# Altium project FLS ADC_A Aug_14_2012.PrjPcb
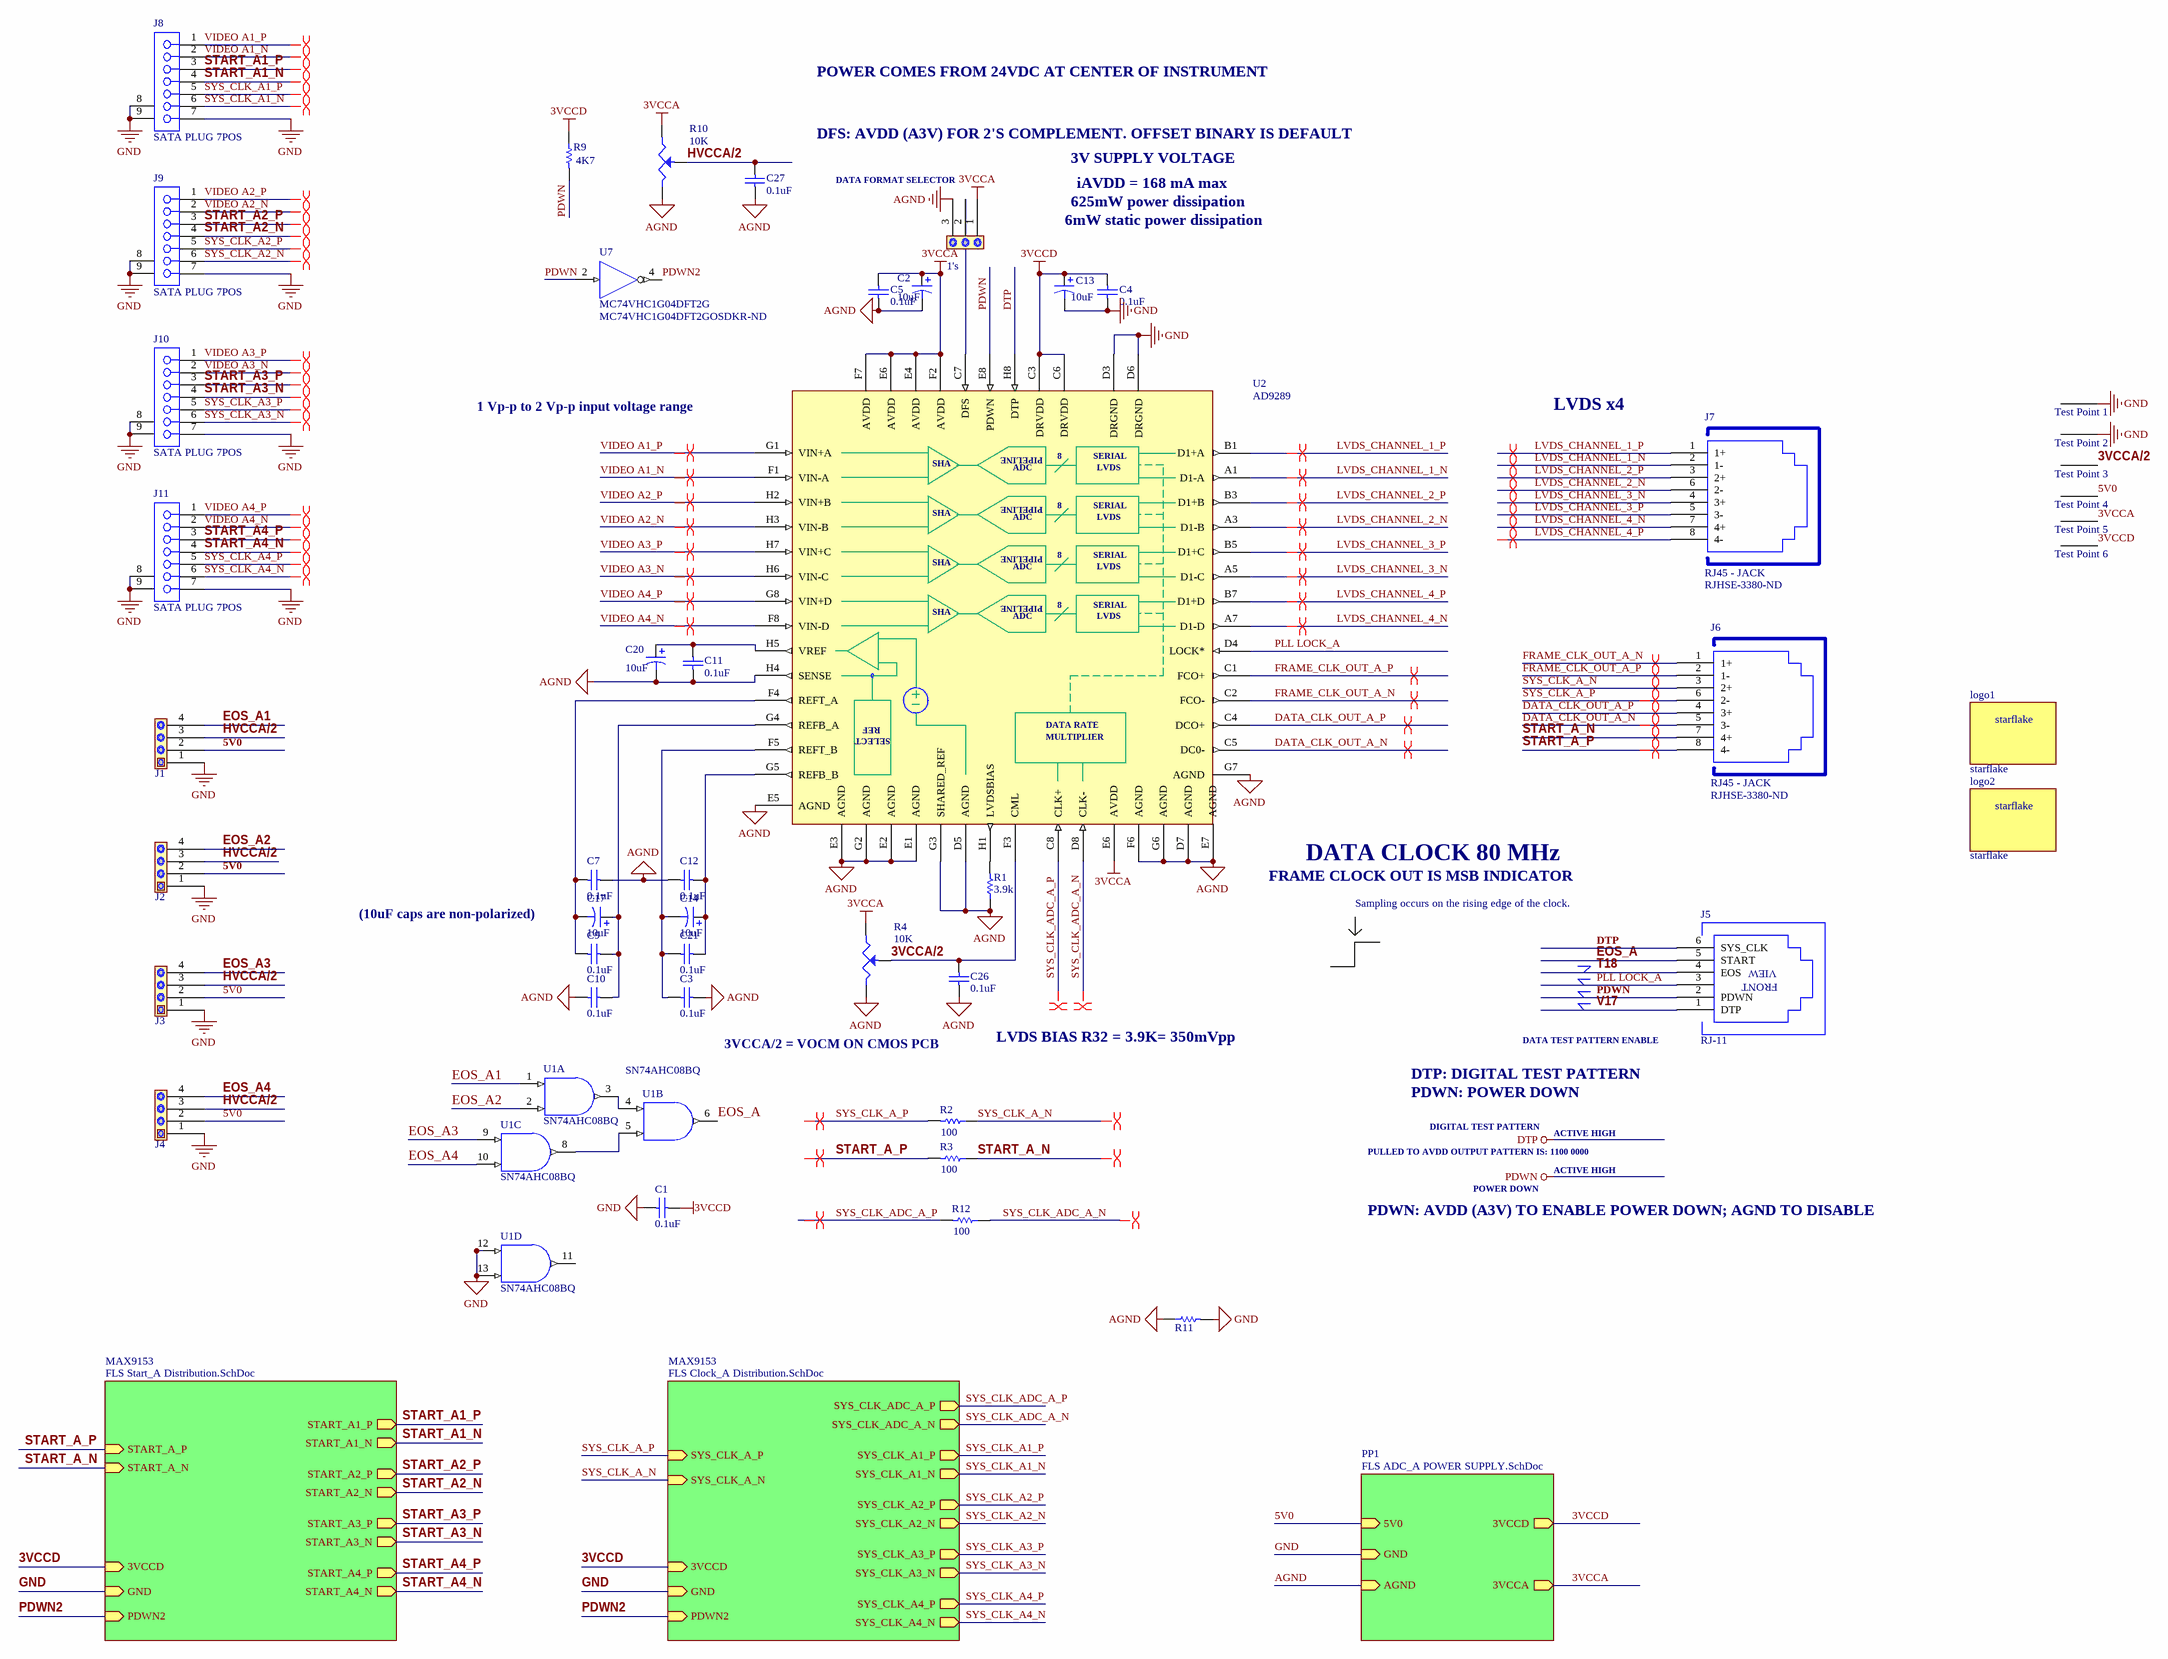
[diagram p0: FLS ADC_ A.SchDoc]
4 sheets, 63 parts. Net scope: hierarchical (ports join the sheet entries above them; power ports are global).
Board file: FLS ADC_A.PcbDoc
Sheets:
  FLS ADC_ A.SchDoc
    PP1 = FLS ADC_A POWER SUPPLY.SchDoc
    MAX9153 = FLS Clock_A Distribution.SchDoc
    MAX9153 = FLS Start_A Distribution.SchDoc

## Sheet FLS ADC_ A.SchDoc
size 558 x 401 mm; Organization: Carnegie Institution of Washington; SheetNumber: 1; SheetTotal: 0; CompanyName: Carnegie Observatories; DrawnBy: alanb; Engineer: Alan Bagish; PageSetup: Record=PageOptions|CenterHorizontal=True|CenterVertical=True|PrintScale=0.47|XCorrection=1.00|YCorrection=1.00|PrintKind=0|BorderSize=5000000|LeftOffset=0|BottomOffset=0|Orientation=2|PaperLength=1000|PaperWidth=1000|Scale=100|PaperSource=259|PrintQuality=600|MediaType=1|DitherType=10|PaperKind=Letter (8.5 x 11")|PrintScaleMode=1; DocumentName: FLS FRONT END

### Parts
1's  SW-SPDT  [SIP3]  (value not drawn)
C1  0.1uF  [0805 slim]
C2  10uF  [1206]
C3  0.1uF  [0805 slim]
C4  0.1uF  [0805 slim]
C5  0.1uF  [0805 slim]
C7  0.1uF  [0805 slim]
C9  0.1uF  [0805 slim]
C10  0.1uF  [0805 slim]
C11  0.1uF  [0805 slim]
C12  0.1uF  [0805 slim]
C13  10uF  [1206]
C14  10uF  [1206]
C17  10uF  [1206]
C20  10uF  [1206]
C21  0.1uF  [0805 slim]
C26  0.1uF  [0805 slim]
C27  0.1uF  [0805 slim]
J1  CON4  [SIP4]  (value not drawn)
J2  CON4  [SIP4]  (value not drawn)
J3  CON4  [SIP4]  (value not drawn)
J4  CON4  [SIP4]  (value not drawn)
J5  RJ-11  [RJ11 - Vertical]
J6  RJ45 - JACK  Supplier Part Number 1: RJHSE-3380-ND  [RJ45 Vertical Single]
J7  RJ45 - JACK  Supplier Part Number 1: RJHSE-3380-ND  [RJ45 Vertical Single]
J8  SATA PLUG 7POS  [Molex 471554001]
J9  SATA PLUG 7POS  [Molex 471554001]
J10  SATA PLUG 7POS  [Molex 471554001]
J11  SATA PLUG 7POS  [Molex 471554001]
logo1  starflake  [STARFLAKE]
logo2  starflake  [STARFLAKE]
R1  value 3.9k  [J1-0603]  (hidden comment: 100)
R2  100  [J1-0603]
R3  100  [J1-0603]
R4  10K  [V1240W]
R9  4K7  [1206]
R10  10K  [V1240W]
R11  Jumper 0805(2012)  [RESC0805(2012)_N]  (value not drawn)
R12  100  [J1-0603]
Test_Point_1  TP-107  [TP-107]  (value not drawn)
Test_Point_2  TP-107  [TP-107]  (value not drawn)
Test_Point_3  TP-107  [TP-107]  (value not drawn)
Test_Point_4  TP-107  [TP-107]  (value not drawn)
Test_Point_5  TP-107  [TP-107]  (value not drawn)
Test_Point_6  TP-107  [TP-107]  (value not drawn)
U1  SN74AHC08BQ  [DGV014]  (parts A,B,C,D of 4)
U2  AD9289  [BGA80P8X8-64B]
U7  MC74VHC1G04DFT2G  Supplier Part Number 1: MC74VHC1G04DFT2GOSDKR-ND  [419A-01_N]

### Sub-sheets
MAX9153 = FLS Clock_A Distribution.SchDoc: GND (in), 3VCCD (in), SYS_CLK_A1_P (out), SYS_CLK_A1_N (out), SYS_CLK_A2_P (out), SYS_CLK_A2_N (out), SYS_CLK_A3_P (out), SYS_CLK_A3_N (out), SYS_CLK_A4_P (out), SYS_CLK_A4_N (out), SYS_CLK_ADC_A_P (out), SYS_CLK_ADC_A_N (out), PDWN2 (in), SYS_CLK_A_P (in), SYS_CLK_A_N (in)
MAX9153 = FLS Start_A Distribution.SchDoc: GND (in), 3VCCD (in), START_A2_P (out), START_A2_N (out), START_A3_P (out), START_A3_N (out), START_A4_P (out), START_A4_N (out), START_A1_P (out), START_A1_N (out), PDWN2 (in), START_A_P (in), START_A_N (in)
PP1 = FLS ADC_A POWER SUPPLY.SchDoc: 5V0 (in), GND (in), 3VCCD (out), 3VCCA (out), AGND (in)

### Nets
3VCCA: 1's.1 C2.1 C5.1 R4.CCW R10.CCW Test_Point_5.1 U2.E4(AVDD) U2.E6(AVDD) U2.F2(AVDD) U2.F7(AVDD) ; sheet PP1/3VCCA
3VCCD: C1.2 C4.1 C13.1 R9.1 Test_Point_6.1 U1.14(VCC) U2.C3(DRVDD) U2.C6(DRVDD) U7.5(VDD) ; sheet PP1/3VCCD, sheet MAX9153/3VCCD, sheet MAX9153/3VCCD
AGND: 1's.3 C2.2 C3.2 C5.2 C7.2 C10.1 C11.2 C12.1 C20.2 C26.1 C27.1 R1.1 R4.CW R10.CW R11.1 U2.D5(AGND) U2.D7(AGND) U2.E1(AGND) U2.E2(AGND) U2.E3(AGND) U2.E5(AGND) U2.E7(AGND) U2.F6(AGND) U2.G2(AGND) U2.G3(SHARED_REF) U2.G6(AGND) U2.G7(AGND) U2.H4(SENSE) ; sheet PP1/AGND
DTP: J5.6(SYS_CLK) U2.H8(DTP)
GND: C1.1 C4.2 C13.2 J1.1 J2.1 J3.1 J4.1 J6.MH3 J6.MH4 J7.MH3 J7.MH4 J8.7 J8.8(MH1) J8.9(MH2) J9.7 J9.8(MH1) J9.9(MH2) J10.7 J10.8(MH1) J10.9(MH2) J11.7 J11.8(MH1) J11.9(MH2) R11.2 Test_Point_1.1 Test_Point_2.1 U1.7(GND) U1.12(A) U1.13(B) U2.D3(DRGND) U2.D6(DRGND) U7.3(GND) ; sheet PP1/GND, sheet MAX9153/GND, sheet MAX9153/GND
PDWN: J5.2(PDWN) R9.2 U2.E8(PDWN) U7.2(IN)
3VCCA/2: C26.2 R4.W Test_Point_3.1 U2.F3(CML)
5V0: J1.2 J2.2 J3.2 J4.2 Test_Point_4.1 ; sheet PP1/5V0
DATA_CLK_OUT_A_N: J6.5(3-) U2.C5(DC0-)
DATA_CLK_OUT_A_P: J6.4(3+) U2.C4(DCO+)
EOS_A: J5.5(START) U1.6(Y)
EOS_A1: J1.4 U1.1(A)
EOS_A2: J2.4 U1.2(B)
EOS_A3: J3.4 U1.9(A)
EOS_A4: J4.4 U1.10(B)
FRAME_CLK_OUT_A_N: J6.1(1+) U2.C2(FCO-)
FRAME_CLK_OUT_A_P: J6.2(1-) U2.C1(FCO+)
HVCCA/2: C27.2 J1.3 J2.3 J3.3 J4.3 R10.W
LVDS_CHANNEL_1_N: J7.2(1-) U2.A1(D1-A)
LVDS_CHANNEL_1_P: J7.1(1+) U2.B1(D1+A)
LVDS_CHANNEL_2_N: J7.6(2-) U2.A3(D1-B)
LVDS_CHANNEL_2_P: J7.3(2+) U2.B3(D1+B)
LVDS_CHANNEL_3_N: J7.4(3+) U2.A5(D1-C)
LVDS_CHANNEL_3_P: J7.5(3-) U2.B5(D1+C)
LVDS_CHANNEL_4_N: J7.7(4+) U2.A7(D1-D)
LVDS_CHANNEL_4_P: J7.8(4-) U2.B7(D1+D)
PDWN2: U7.4(~{OUT}) ; sheet MAX9153/PDWN2, sheet MAX9153/PDWN2
PLL LOCK_A: J5.3 U2.D4(LOCK*)
START_A1_N: J8.4 ; sheet MAX9153/START_A1_N
START_A1_P: J8.3 ; sheet MAX9153/START_A1_P
START_A2_N: J9.4 ; sheet MAX9153/START_A2_N
START_A2_P: J9.3 ; sheet MAX9153/START_A2_P
START_A3_N: J10.4 ; sheet MAX9153/START_A3_N
START_A3_P: J10.3 ; sheet MAX9153/START_A3_P
START_A4_N: J11.4 ; sheet MAX9153/START_A4_N
START_A4_P: J11.3 ; sheet MAX9153/START_A4_P
START_A_N: J6.7(4+) R3.1 ; sheet MAX9153/START_A_N
START_A_P: J6.8(4-) R3.2 ; sheet MAX9153/START_A_P
SYS_CLK_A1_N: J8.6 ; sheet MAX9153/SYS_CLK_A1_N
SYS_CLK_A1_P: J8.5 ; sheet MAX9153/SYS_CLK_A1_P
SYS_CLK_A2_N: J9.6 ; sheet MAX9153/SYS_CLK_A2_N
SYS_CLK_A2_P: J9.5 ; sheet MAX9153/SYS_CLK_A2_P
SYS_CLK_A3_N: J10.6 ; sheet MAX9153/SYS_CLK_A3_N
SYS_CLK_A3_P: J10.5 ; sheet MAX9153/SYS_CLK_A3_P
SYS_CLK_A4_N: J11.6 ; sheet MAX9153/SYS_CLK_A4_N
SYS_CLK_A4_P: J11.5 ; sheet MAX9153/SYS_CLK_A4_P
SYS_CLK_A_N: J6.3(2+) R2.1 ; sheet MAX9153/SYS_CLK_A_N
SYS_CLK_A_P: J6.6(2-) R2.2 ; sheet MAX9153/SYS_CLK_A_P
SYS_CLK_ADC_A_N: R12.1 U2.D8(CLK-) ; sheet MAX9153/SYS_CLK_ADC_A_N
SYS_CLK_ADC_A_P: R12.2 U2.C8(CLK+) ; sheet MAX9153/SYS_CLK_ADC_A_P
T18: J5.4(EOS)
V17: J5.1(DTP)
VIDEO A1_N: J8.2 U2.F1(VIN-A)
VIDEO A1_P: J8.1 U2.G1(VIN+A)
VIDEO A2_N: J9.2 U2.H3(VIN-B)
VIDEO A2_P: J9.1 U2.H2(VIN+B)
VIDEO A3_N: J10.2 U2.H6(VIN-C)
VIDEO A3_P: J10.1 U2.H7(VIN+C)
VIDEO A4_N: J11.2 U2.F8(VIN-D)
VIDEO A4_P: J11.1 U2.G8(VIN+D)
Net1's_2: 1's.2 U2.C7(DFS)
NetC3_1: C3.1 C14.2 C21.1 U2.F5(REFT_B)
NetC7_1: C7.1 C9.1 C17.2 U2.F4(REFT_A)
NetC9_2: C9.2 C10.2 C17.1 U2.G4(REFB_A)
NetC11_1: C11.1 C20.1 U2.H5(VREF)
NetC12_2: C12.2 C14.1 C21.2 U2.G5(REFB_B)
NetR1_2: R1.2 U2.H1(LVDSBIAS)
NetU1_3: U1.3(Y) U1.4(A)
NetU1_5: U1.5(B) U1.8(Y)

Not connected (* = marked no-connect by the designer): J6 MH1 MH2; J7 MH1 MH2; U1 11(Y)

### Layout directives
differential pair: DATA_CLK_OUT_A_N, DATA_CLK_OUT_A_P, FRAME_CLK_OUT_A_N, FRAME_CLK_OUT_A_P, LVDS_CHANNEL_1_N, LVDS_CHANNEL_1_P, LVDS_CHANNEL_2_N, LVDS_CHANNEL_2_P, LVDS_CHANNEL_3_N, LVDS_CHANNEL_3_P, LVDS_CHANNEL_4_N, LVDS_CHANNEL_4_P, START_A1_N, START_A1_P, START_A2_N, START_A2_P, START_A3_N, START_A3_P, START_A4_N, START_A4_P, START_A_N, START_A_P, SYS_CLK_A1_N, SYS_CLK_A1_P, SYS_CLK_A2_N, SYS_CLK_A2_P, SYS_CLK_A3_N, SYS_CLK_A3_P, SYS_CLK_A4_N, SYS_CLK_A4_P, SYS_CLK_A_N, SYS_CLK_A_P, SYS_CLK_ADC_A_N, SYS_CLK_ADC_A_P, VIDEO A1_N, VIDEO A1_P, VIDEO A2_N, VIDEO A2_P, VIDEO A3_N, VIDEO A3_P, VIDEO A4_N, VIDEO A4_P

### Notes on the sheet
- POWER COMES FROM 24VDC AT CENTER OF INSTRUMENT
- DFS: AVDD (A3V) FOR 2'S COMPLEMENT. OFFSET BINARY IS DEFAULT
- DATA FORMAT SELECTOR
- 3V SUPPLY VOLTAGE
- iAVDD = 168 mA max
- 6mW static power dissipation
- 625mW power dissipation
- 1 Vp-p to 2 Vp-p input voltage range
- LVDS x4
- FRAME CLOCK OUT IS MSB INDICATOR
- DATA CLOCK 80 MHz
- (10uF caps are non-polarized)
- Sampling occurs on the rising edge of the clock.
- 3VCCA/2 = VOCM ON CMOS PCB
- LVDS BIAS R32 = 3.9K= 350mVpp
- DATA TEST PATTERN ENABLE
- DTP: DIGITAL TEST PATTERN
- PDWN: POWER DOWN
- DIGITAL TEST PATTERN
- ACTIVE HIGH
- PULLED TO AVDD OUTPUT PATTERN IS: 1100 0000
- POWER DOWN
- PDWN: AVDD (A3V) TO ENABLE POWER DOWN; AGND TO DISABLE
- Carnegie Institution of Washington
- 813 Santa Barbara Street
- The Observatories
- PHONE (626) 577-1122               FAX (626) 795-8136
- Pasadena, California 91101
- Title:
- OCIW
- Size:
- Date:
- C
- Scale:
- Drawn By:
- Checked By:
- A. BAGISH
- alanb
- Revision:
- Sheet          of
- File:
- (in symbol AD9289) PIPELINE; 8; SERIAL; SHA; ADC; LVDS; REF; DATA RATE; SELECT; MULTIPLIER
- (in symbol RJ-11) VIEW; FRONT

### Library data of the parts
1's = TP3
C1 C3-C5 C7 C9-C12 C21 C26 C27 = Cap: Capacitor; Murata Electronics North America: GRM216F51E104ZA01D; Published: 8-Jun-2000; LatestRevisionDate: 17-Jul-2002; LatestRevisionNote: Re-released for DXP Platform.; PackageReference: RAD-0.3; Publisher: Altium Limited; Value: 0.1uF; Digi-Key: 490-1726-2-ND; Footprint: 0805
C2 C13 C14 C17 C20 = Cap Pol3: Polarized Capacitor (Surface Mount); TDK Corporation: C2012Y5V1A106Z; Description: CAP CER 10UF 10V Y5V 0805; Published: 8-Jun-2000; LatestRevisionDate: 29-May-2009; Footprint: 0805 (2012 Metric); PackageReference: C0805; Publisher: Altium Limited; PackageDescription: Chip Capacitor; Value: 10uF; Digi-Key: 445-1371-6-ND
J5 = RJ-11: RJ-11 6-PIN CONNECTOR; TE Connectivity: 5520258-3; Description: CONN MOD JACK 6-6 VERT PCB 50AU; Digi-Key Part Number: A31411-ND
J6 J7 = RJ45 - JACK: Manufacturer: Amphenol Commercial Products; Description: CONN RJ45 MOD JACK VERT SHIELD; Number of Positions/Contacts: 8p8c (RJ45, Ethernet); Manufactuer Part Number: RJHSE-3380; Digi-Key Part Number: RJHSE-3380-ND; Supplier 1: Digi-Key
R1-R3 R9 R12 = Res1: Resistor; Published: 8-Jun-2000; LatestRevisionDate: 17-Jul-2002; LatestRevisionNote: Re-released for DXP Platform.; PackageReference: AXIAL-0.3; Publisher: Altium Limited
  R2 R3 R12: Value: 100
  R9: Value: 4K7
R4 R10 = POT1: Vishay Foil Resistors (Division of Vishay Precision Group): Y405310K0000J0L; Description: TRIMMER 10K OHM 0.25W TH; Temperature Coefficient: ±10ppm/°C; Digi-Key Part Number: 804-1003-ND; Series: Accutrim 1240W
R11 = CMP-1013-00001-1: Jumper 0805 (2012 Metric); Case-EIA: 0805; Value: 0.5 Ohm; Tolerance: None; Case-Metric: 2012; Technology: SMT; Power: None
U1 = SN74AHC08DBLE: Quadruple 2-Input Positive-AND Gate; Published: 8-Jun-2000; LatestRevisionDate: 04-Mar-2005; LatestRevisionNote: Stylized 3D Model Added.; DatasheetVersion: Jul-1998; PackageVersion: May-1999; PackageReference: DB014; Publisher: Altium Limited; PackageDescription: SSOP, Plastic; 14 Leads; Body Width 5.3 mm; Pitch 0.65 mm; Code_JEDEC: MO-150-AB; ComponentLink1Description: Manufacturer Link; ComponentLink1URL: http://www.ti.com/; ComponentLink2Description: Datasheet; ComponentLink2URL: http://www-s.ti.com/sc/ds/sn74ahc08.pdf; ComponentLink3Description: Packaging Specification; ComponentLink3URL: http://focus.ti.com/lit/ml/msso002e/msso002e.pdf
U7 = MC74VHC1G04DFT1: Inverter; Note: Pin 1 is NC and is not drawn.; Published: 15-Apr-2002; LatestRevisionDate: 12-Dec-2006; LatestRevisionNote: IPC-7351 Footprint Added.; DatasheetVersion: 1999; PackageVersion: Oct-1999; PackageReference: 419A-01; Publisher: Altium Limited; PackageDescription: 5-Pin SOT-353 Package 0.65 mm Pitch, 2.1 mm Lead Span; ComponentLink1Description: Manufacturer Link; ComponentLink1URL: http://www.onsemi.com/; ComponentLink2Description: Datasheet; ComponentLink2URL: http://www.onsemi.com/pub/Collateral/MC74VHC1G04-D.PDF; Supplier 1: Digi-Key

## Sheet FLS ADC_A POWER SUPPLY.SchDoc
size 558 x 401 mm; Organization: Carnegie Institution of Washington; SheetNumber: 0; SheetTotal: 0; PageSetup: Record=PageOptions|CenterHorizontal=True|CenterVertical=True|PrintScale=0.47|XCorrection=1.00|YCorrection=1.00|PrintKind=1|BorderSize=5000000|LeftOffset=0|BottomOffset=0|Orientation=2|PaperLength=1000|PaperWidth=1000|Scale=100|PaperSource=259|PrintQuality=600|MediaType=1|DitherType=10|PaperKind=Letter (8.5 x 11")|PrintScaleMode=1
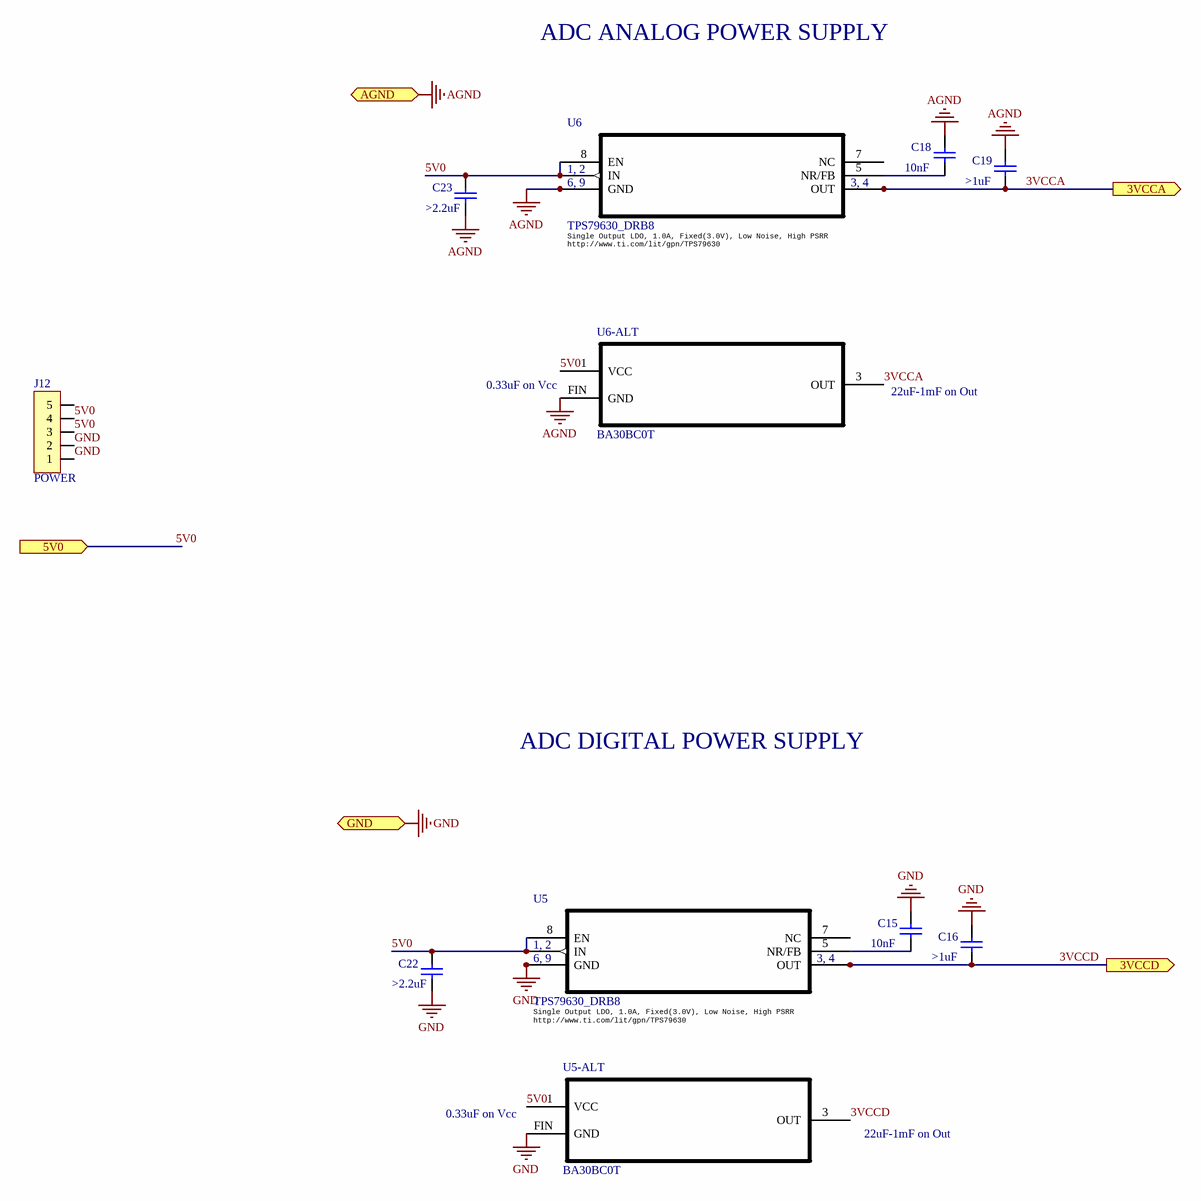
[diagram p1: FLS ADC_A POWER SUPPLY.SchDoc]

### Parts
C15  value 10nF  [1608[0603]]  (hidden comment: 0.1uF)
C16  value >1uF  [0805 slim outer]  (hidden comment: 0.1uF)
C18  value 10nF  [1608[0603]]  (hidden comment: 0.1uF)
C19  value >1uF  [0805 slim outer]  (hidden comment: 0.1uF)
C22  value >2.2uF  [1608[0603]]  (hidden comment: 0.1uF)
C23  value >2.2uF  [1608[0603]]  (hidden comment: 0.1uF)
J12  POWER  [SIP5]
U5  TPS79630_DRB8  DESCRIPTION: Single Output LDO, 1.0A, Fixed(3.0V), Low Noise, High PSRR  [DRB8_2P4X1P65]
U5-ALT  BA30BC0T  [TO252-3]
U6  TPS79630_DRB8  DESCRIPTION: Single Output LDO, 1.0A, Fixed(3.0V), Low Noise, High PSRR  [DRB8_2P4X1P65]
U6-ALT  BA30BC0T  [TO252-3]

### Ports
3VCCA (out), 3VCCD (out), 5V0 (in), AGND (in), GND (in)

### Nets
3VCCA: C19.1 U6.3(OUT) U6.4(OUT) U6-ALT.3(OUT) ; port 3VCCA
3VCCD: C16.1 U5.3(OUT) U5.4(OUT) U5-ALT.3(OUT) ; port 3VCCD
AGND: C18.2 C19.2 C23.1 U6.6(GND) U6.9 U6.V_1 U6.V_2 U6.V_3 U6.V_4 U6.V_5 U6.V_6 U6-ALT.FIN(GND) ; port AGND
GND: C15.2 C16.2 C22.1 J12.1 J12.2 U5.6(GND) U5.9 U5.V_1 U5.V_2 U5.V_3 U5.V_4 U5.V_5 U5.V_6 U5-ALT.FIN(GND) ; port GND
5V0: C22.2 C23.2 J12.3 J12.4 U5.1(IN) U5.2(IN) U5.8(EN) U5-ALT.1(VCC) U6.1(IN) U6.2(IN) U6.8(EN) U6-ALT.1(VCC) ; port 5V0
NetC15_1: C15.1 U5.5(NR/FB)
NetC18_1: C18.1 U6.5(NR/FB)

Not connected (* = marked no-connect by the designer): J12 5; U5 7(NC); U6 7(NC)

### Notes on the sheet
- ADC ANALOG POWER SUPPLY
- (near U6-ALT) 0.33uF on Vcc
- (near U6-ALT) 22uF-1mF on Out
- ADC DIGITAL POWER SUPPLY
- (near U5-ALT) 0.33uF on Vcc
- 22uF-1mF on Out
- Carnegie Institution of Washington
- 813 Santa Barbara Street
- The Observatories
- PHONE (626) 577-1122               FAX (626) 795-8136
- Pasadena, California 91101
- Title:
- OCIW
- Size:
- Date:
- C
- Scale:
- Drawn By:
- Checked By:
- A. BAGISH
- alanb
- Revision:
- Sheet          of
- File:
- (in symbol TPS79630_DRB8) 1, 2; 6, 9; 3, 4

### Library data of the parts
C15 C16 C18 C19 C22 C23 = Cap: Capacitor; Taiyo Yuden: UMK212B7224KG-T; Description: CAP CER 0.22UF 50V 10% X7R 0805; Published: 8-Jun-2000; LatestRevisionDate: 17-Jul-2002; LatestRevisionNote: Re-released for DXP Platform.; PackageReference: 0805 (2012 Metric); Publisher: Altium Limited; Digi-Key Part Number: 587-1287-6-ND
J12 = CON5
U5 U6 = TPS79630_DRB8: Imported; Datasheet URL: http://www.ti.com/lit/gpn/TPS79630

## Sheet FLS Clock_A Distribution.SchDoc
size 558 x 401 mm; Organization: Carnegie Institution of Washington; SheetNumber: 0; SheetTotal: 0; PageSetup: Record=PageOptions|CenterHorizontal=True|CenterVertical=True|PrintScale=0.47|XCorrection=1.00|YCorrection=1.00|PrintKind=0|BorderSize=5000000|LeftOffset=0|BottomOffset=0|Orientation=2|PaperLength=1000|PaperWidth=1000|Scale=100|PaperSource=259|PrintQuality=600|MediaType=1|DitherType=10|PaperKind=Letter (8.5 x 11")|PrintScaleMode=1
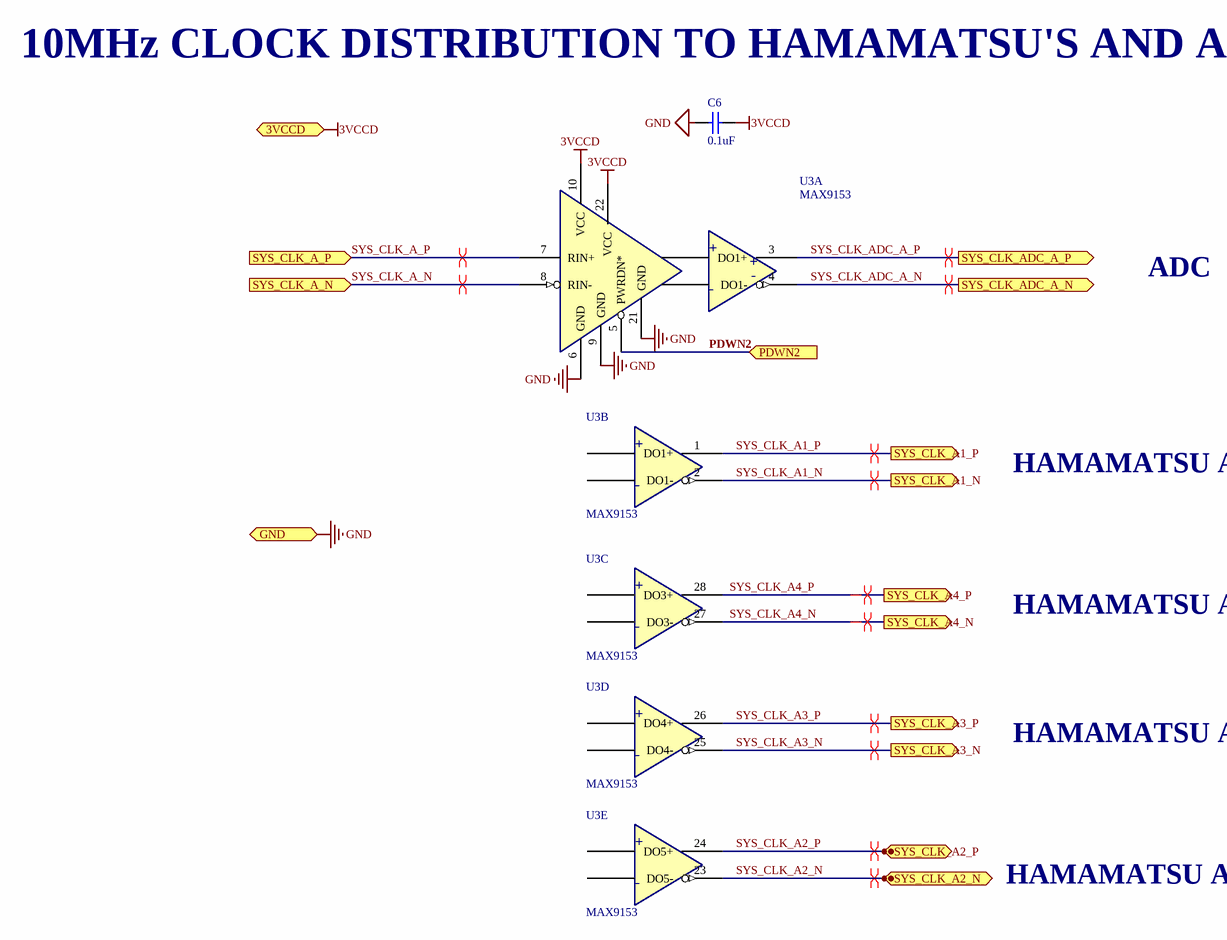
[diagram p2: FLS Clock_A Distribution.SchDoc]

### Parts
C6  0.1uF  [0805 slim]
U3  MAX9153  [MAX9153EUI]  (parts A,B,C,D,E of 10)

### Ports
3VCCD (in), GND (in), PDWN2 (in), SYS_CLK_A1_N (out), SYS_CLK_A1_P (out), SYS_CLK_A2_N (out), SYS_CLK_A2_P (out), SYS_CLK_A3_N (out), SYS_CLK_A3_P (out), SYS_CLK_A4_N (out), SYS_CLK_A4_P (out), SYS_CLK_A_N (in), SYS_CLK_A_P (in), SYS_CLK_ADC_A_N (out), SYS_CLK_ADC_A_P (out)

### Nets
3VCCD: C6.2 U3.10(VCC) U3.22(VCC) ; port 3VCCD
GND: C6.1 U3.6(GND) U3.9(GND) U3.21(GND) ; port GND
PDWN2: U3.5(PWRDN*) ; port PDWN2
SYS_CLK_A1_N: U3.2(DO1-) ; port SYS_CLK_A1_N
SYS_CLK_A1_P: U3.1(DO1+) ; port SYS_CLK_A1_P
SYS_CLK_A2_N: U3.23(DO5-) ; port SYS_CLK_A2_N
SYS_CLK_A2_P: U3.24(DO5+) ; port SYS_CLK_A2_P
SYS_CLK_A3_N: U3.25(DO4-) ; port SYS_CLK_A3_N
SYS_CLK_A3_P: U3.26(DO4+) ; port SYS_CLK_A3_P
SYS_CLK_A4_N: U3.27(DO3-) ; port SYS_CLK_A4_N
SYS_CLK_A4_P: U3.28(DO3+) ; port SYS_CLK_A4_P
SYS_CLK_A_N: U3.8(RIN-) ; port SYS_CLK_A_N
SYS_CLK_A_P: U3.7(RIN+) ; port SYS_CLK_A_P
SYS_CLK_ADC_A_N: U3.4(DO1-) ; port SYS_CLK_ADC_A_N
SYS_CLK_ADC_A_P: U3.3(DO1+) ; port SYS_CLK_ADC_A_P

### Layout directives
differential pair: SYS_CLK_A1_N, SYS_CLK_A1_P, SYS_CLK_A2_N, SYS_CLK_A2_P, SYS_CLK_A3_N, SYS_CLK_A3_P, SYS_CLK_A4_N, SYS_CLK_A4_P, SYS_CLK_A_N, SYS_CLK_A_P, SYS_CLK_ADC_A_N, SYS_CLK_ADC_A_P

### Notes on the sheet
- 10MHz CLOCK DISTRIBUTION TO HAMAMATSU'S AND ADC
- ADC
- HAMAMATSU A1
- HAMAMATSU A4
- HAMAMATSU A3
- HAMAMATSU A2
- Carnegie Institution of Washington
- 813 Santa Barbara Street
- The Observatories
- PHONE (626) 577-1122               FAX (626) 795-8136
- Pasadena, California 91101
- Title:
- OCIW
- Size:
- Date:
- C
- Scale:
- Drawn By:
- Checked By:
- A. BAGISH
- alanb
- Revision:
- Sheet          of
- File:
- (in symbol MAX9153, part A) +; -
- (in symbol MAX9153, part B) +; -
- (in symbol MAX9153, part C) +; -
- (in symbol MAX9153, part D) +; -
- (in symbol MAX9153, part E) +; -

### Library data of the parts
C6 = Cap: as C1 on sheet FLS ADC_ A; Published: 8-Jun-2000; LatestRevisionDate: 17-Jul-2002; LatestRevisionNote: Re-released for DXP Platform.; PackageReference: RAD-0.3; Publisher: Altium Limited; Value: 0.1uF; Digi-Key: 490-1726-2-ND; Footprint: 0805

## Sheet FLS Start_A Distribution.SchDoc
size 558 x 401 mm; Organization: Carnegie Institution of Washington; SheetNumber: 0; SheetTotal: 0; PageSetup: Record=PageOptions|CenterHorizontal=True|CenterVertical=True|PrintScale=0.47|XCorrection=1.00|YCorrection=1.00|PrintKind=0|BorderSize=5000000|LeftOffset=0|BottomOffset=0|Orientation=2|PaperLength=1000|PaperWidth=1000|Scale=100|PaperSource=259|PrintQuality=600|MediaType=1|DitherType=10|PaperKind=Letter (8.5 x 11")|PrintScaleMode=1
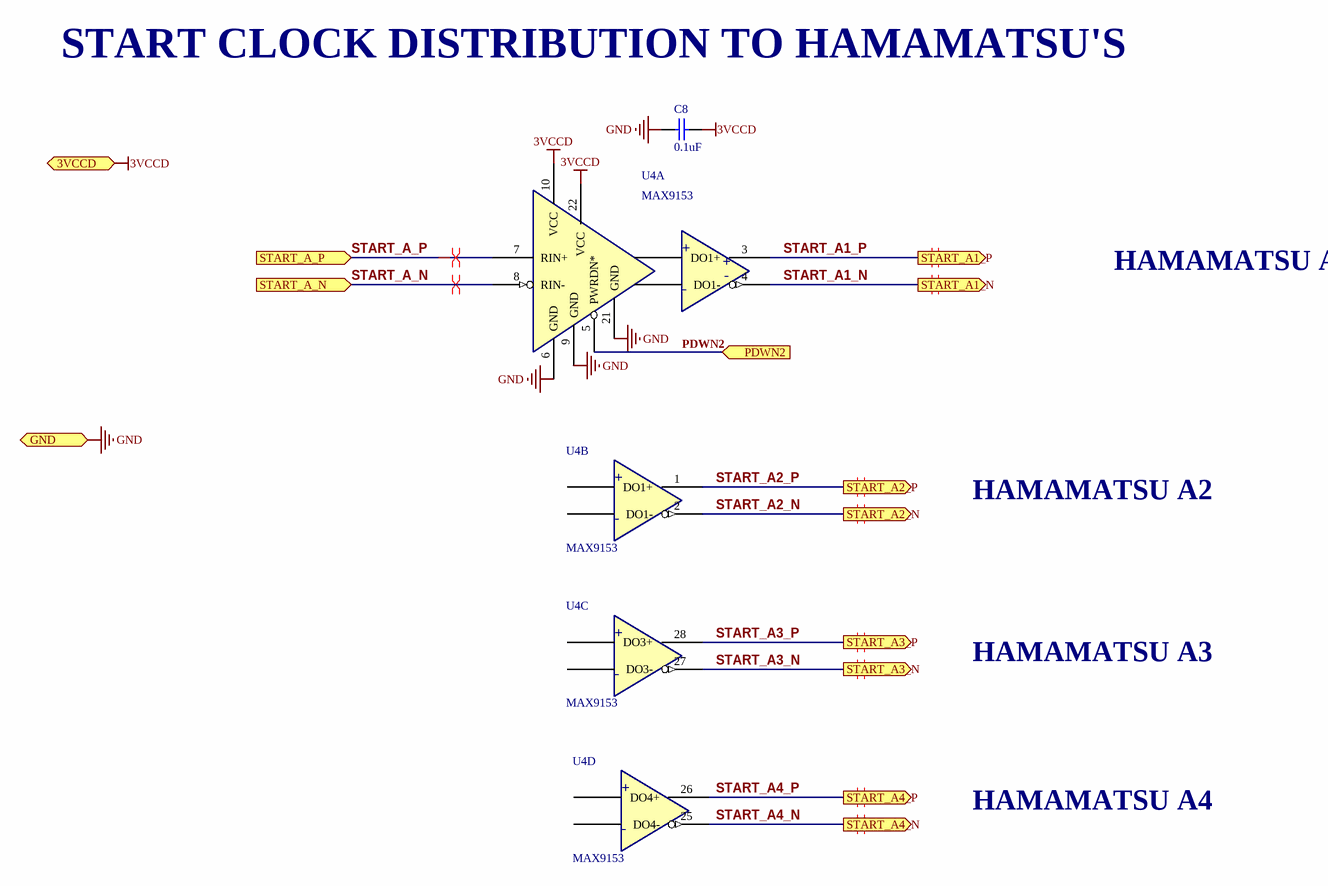
[diagram p3: FLS Start_A Distribution.SchDoc]

### Parts
C8  0.1uF  [0805 slim]
U4  MAX9153  [MAX9153EUI]  (parts A,B,C,D of 10)

### Ports
3VCCD (in), GND (in), PDWN2 (in), START_A1_N (out), START_A1_P (out), START_A2_N (out), START_A2_P (out), START_A3_N (out), START_A3_P (out), START_A4_N (out), START_A4_P (out), START_A_N (in), START_A_P (in)

### Nets
3VCCD: C8.2 U4.10(VCC) U4.22(VCC) ; port 3VCCD
GND: C8.1 U4.6(GND) U4.9(GND) U4.21(GND) ; port GND
PDWN2: U4.5(PWRDN*) ; port PDWN2
START_A1_N: U4.4(DO1-) ; port START_A1_N
START_A1_P: U4.3(DO1+) ; port START_A1_P
START_A2_N: U4.2(DO1-) ; port START_A2_N
START_A2_P: U4.1(DO1+) ; port START_A2_P
START_A3_N: U4.27(DO3-) ; port START_A3_N
START_A3_P: U4.28(DO3+) ; port START_A3_P
START_A4_N: U4.25(DO4-) ; port START_A4_N
START_A4_P: U4.26(DO4+) ; port START_A4_P
START_A_N: U4.8(RIN-) ; port START_A_N
START_A_P: U4.7(RIN+) ; port START_A_P

### Layout directives
differential pair: START_A1_N, START_A1_P, START_A2_N, START_A2_P, START_A3_N, START_A3_P, START_A4_N, START_A4_P, START_A_N, START_A_P

### Notes on the sheet
- START CLOCK DISTRIBUTION TO HAMAMATSU'S
- HAMAMATSU A1
- HAMAMATSU A2
- HAMAMATSU A3
- HAMAMATSU A4
- Carnegie Institution of Washington
- 813 Santa Barbara Street
- The Observatories
- PHONE (626) 577-1122               FAX (626) 795-8136
- Pasadena, California 91101
- Title:
- OCIW
- Size:
- Date:
- C
- Scale:
- Drawn By:
- Checked By:
- A. BAGISH
- alanb
- Revision:
- Sheet          of
- File:
- (in symbol MAX9153, part A) +; -
- (in symbol MAX9153, part B) +; -
- (in symbol MAX9153, part C) +; -
- (in symbol MAX9153, part D) +; -

### Library data of the parts
C8 = Cap: as C1 on sheet FLS ADC_ A; Published: 8-Jun-2000; LatestRevisionDate: 17-Jul-2002; LatestRevisionNote: Re-released for DXP Platform.; PackageReference: RAD-0.3; Publisher: Altium Limited; Value: 0.1uF; Digi-Key: 490-1726-2-ND; Footprint: 0805

## Nets that join several sheets
3VCCA: FLS ADC_ A (10 pins), FLS ADC_A POWER SUPPLY (C19.1 U6.3 U6.4 U6-ALT.3)
3VCCD: FLS ADC_ A (9 pins), FLS ADC_A POWER SUPPLY (C16.1 U5.3 U5.4 U5-ALT.3), FLS Clock_A Distribution (C6.2 U3.10 U3.22), FLS Start_A Distribution (C8.2 U4.10 U4.22)
AGND: FLS ADC_ A (28 pins), FLS ADC_A POWER SUPPLY (12 pins)
GND: FLS ADC_ A (32 pins), FLS ADC_A POWER SUPPLY (14 pins), FLS Clock_A Distribution (C6.1 U3.6 U3.9 U3.21), FLS Start_A Distribution (C8.1 U4.6 U4.9 U4.21)
5V0: FLS ADC_ A (5 pins), FLS ADC_A POWER SUPPLY (12 pins)
PDWN2: FLS ADC_ A (U7.4), FLS Clock_A Distribution (U3.5), FLS Start_A Distribution (U4.5)
START_A1_N: FLS ADC_ A (J8.4), FLS Start_A Distribution (U4.4)
START_A1_P: FLS ADC_ A (J8.3), FLS Start_A Distribution (U4.3)
START_A2_N: FLS ADC_ A (J9.4), FLS Start_A Distribution (U4.2)
START_A2_P: FLS ADC_ A (J9.3), FLS Start_A Distribution (U4.1)
START_A3_N: FLS ADC_ A (J10.4), FLS Start_A Distribution (U4.27)
START_A3_P: FLS ADC_ A (J10.3), FLS Start_A Distribution (U4.28)
START_A4_N: FLS ADC_ A (J11.4), FLS Start_A Distribution (U4.25)
START_A4_P: FLS ADC_ A (J11.3), FLS Start_A Distribution (U4.26)
START_A_N: FLS ADC_ A (J6.7 R3.1), FLS Start_A Distribution (U4.8)
START_A_P: FLS ADC_ A (J6.8 R3.2), FLS Start_A Distribution (U4.7)
SYS_CLK_A1_N: FLS ADC_ A (J8.6), FLS Clock_A Distribution (U3.2)
SYS_CLK_A1_P: FLS ADC_ A (J8.5), FLS Clock_A Distribution (U3.1)
SYS_CLK_A2_N: FLS ADC_ A (J9.6), FLS Clock_A Distribution (U3.23)
SYS_CLK_A2_P: FLS ADC_ A (J9.5), FLS Clock_A Distribution (U3.24)
SYS_CLK_A3_N: FLS ADC_ A (J10.6), FLS Clock_A Distribution (U3.25)
SYS_CLK_A3_P: FLS ADC_ A (J10.5), FLS Clock_A Distribution (U3.26)
SYS_CLK_A4_N: FLS ADC_ A (J11.6), FLS Clock_A Distribution (U3.27)
SYS_CLK_A4_P: FLS ADC_ A (J11.5), FLS Clock_A Distribution (U3.28)
SYS_CLK_A_N: FLS ADC_ A (J6.3 R2.1), FLS Clock_A Distribution (U3.8)
SYS_CLK_A_P: FLS ADC_ A (J6.6 R2.2), FLS Clock_A Distribution (U3.7)
SYS_CLK_ADC_A_N: FLS ADC_ A (R12.1 U2.D8), FLS Clock_A Distribution (U3.4)
SYS_CLK_ADC_A_P: FLS ADC_ A (R12.2 U2.C8), FLS Clock_A Distribution (U3.3)